# Altium project Glucometer-I.C.- Mis.PrjPcb
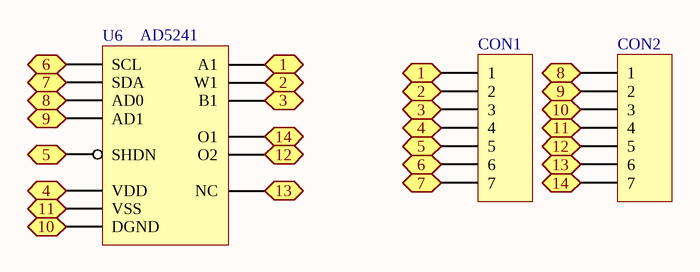
[diagram p0: Glucometer-I.C.- Mis.SchDoc]
1 sheet, 3 parts. Net scope: flat (ports and power ports of the same name join across sheets).
Board files: Glucometer-I.C.- Mis.PcbDoc, Glucometer-I.C.- Mis 1.PcbDoc

## Sheet Glucometer-I.C.- Mis.SchDoc
size A4; PageSetup: Record=PageOptions|CenterHorizontal=True|CenterVertical=True|PrintScale=1.00|XCorrection=1.00|YCorrection=1.00|PrintKind=1|BorderSize=5000000|LeftOffset=0|BottomOffset=0|Orientation=1|PaperLength=1000|PaperWidth=1000|Scale=100|PaperSource=7|PrintQuality=-4|MediaType=1|DitherType=10|PaperKind=A4|PrintScaleMode=1

### Parts
CON1  Header 7  [HDR1X7]  (value not drawn)
CON2  Header 7  [HDR1X7]  (value not drawn)
U6  AD5241  [R-14_N]

### Ports
1, 2, 3, 4, 5, 6, 7, 8, 9, 10, 11, 12, 13, 14

### Nets
NetCON1_1: CON1.1 U6.1(A1) ; port 1
NetCON1_2: CON1.2 U6.2(W1) ; port 2
NetCON1_3: CON1.3 U6.3(B1) ; port 3
NetCON1_4: CON1.4 U6.4(VDD) ; port 4
NetCON1_5: CON1.5 U6.5(SHDN) ; port 5
NetCON1_6: CON1.6 U6.6(SCL) ; port 6
NetCON1_7: CON1.7 U6.7(SDA) ; port 7
NetCON2_1: CON2.1 U6.8(AD0) ; port 8
NetCON2_2: CON2.2 U6.9(AD1) ; port 9
NetCON2_3: CON2.3 U6.10(DGND) ; port 10
NetCON2_4: CON2.4 U6.11(VSS) ; port 11
NetCON2_5: CON2.5 U6.12(O2) ; port 12
NetCON2_6: CON2.6 U6.13(NC) ; port 13
NetCON2_7: CON2.7 U6.14(O1) ; port 14

### Library data of the parts
CON1 CON2 = Header 7: Header, 7-Pin; LatestRevisionDate: 17-Jul-2002; LatestRevisionNote: Re-released for DXP Platform.; Publisher: Altium Limited
U6 = AD5241: AD5241BR